# Altium schematic sheet TD3_TP2_Entradas Analogicas.SchDoc: Técnicas Digitales 3. Práctico 02: Acondicionador de señal
size A4; Date: 19/05/2025; Author: L. Campos; DrawnBy: L. Campos; SheetNumber: 1; SheetTotal: 1; Time: 20:45
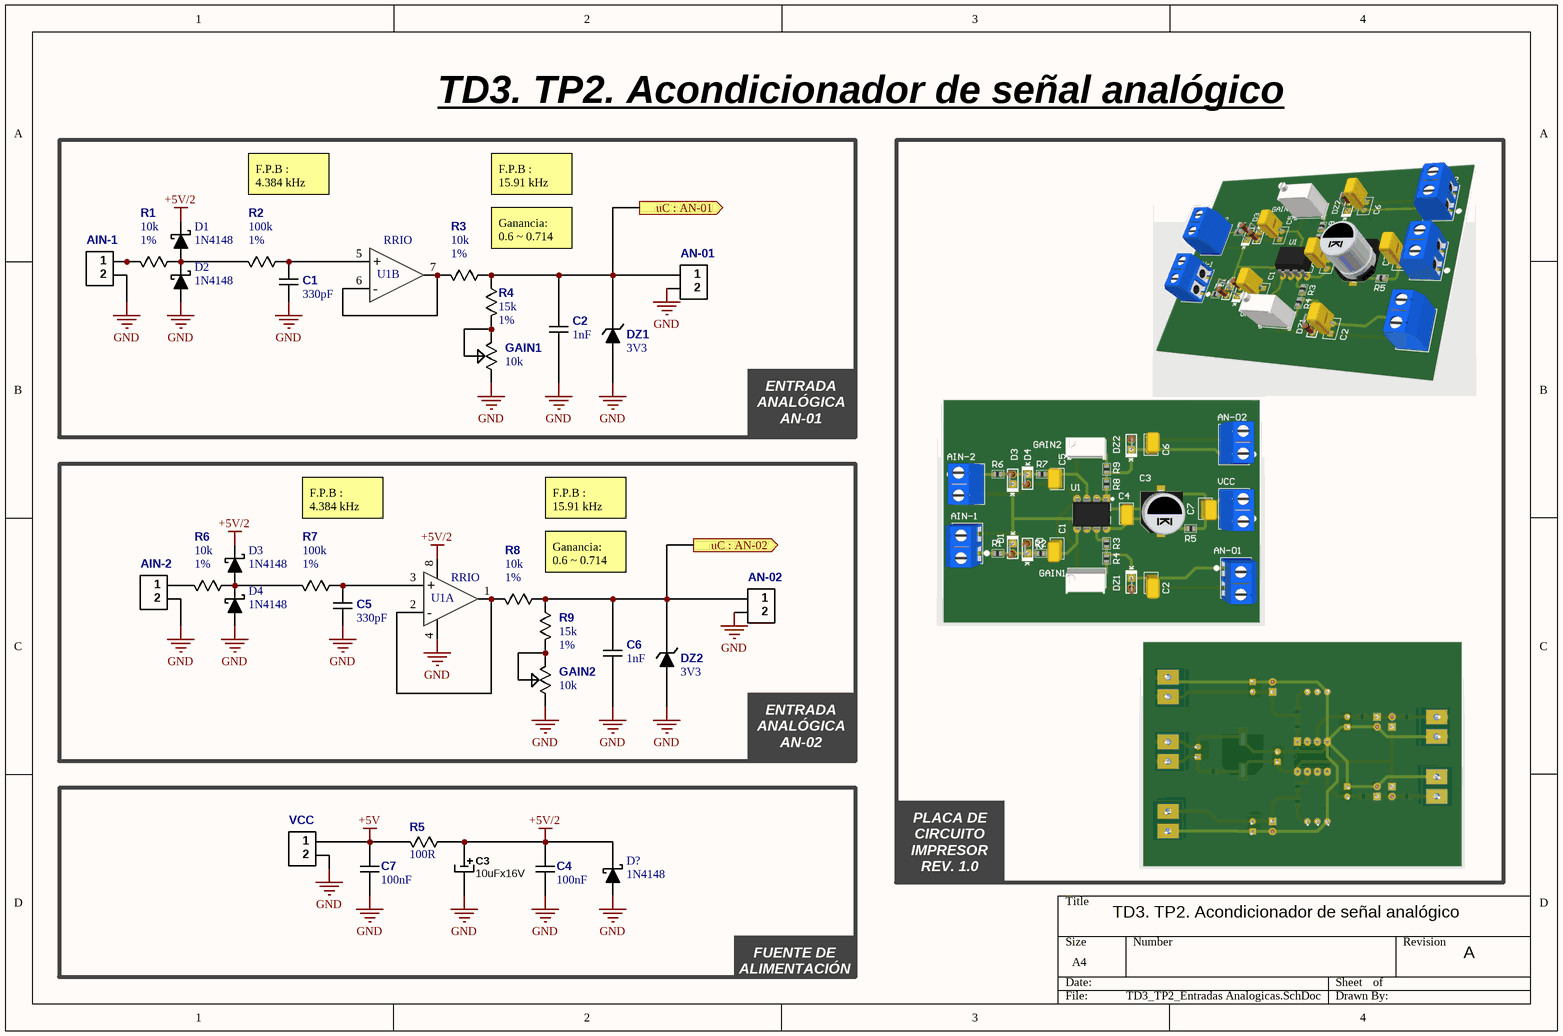
[diagram p0: TD3_TP2_Entradas Analogicas.SchDoc]

## Parts
AIN-1  CONN_2  [BORNERA_2]  (value not drawn)
AIN-2  CONN_2  [BORNERA_2]  (value not drawn)
AN-01  CONN_2  [BORNERA_2]  (value not drawn)
AN-02  CONN_2  [BORNERA_2]  (value not drawn)
C1  330pF  [CAP_0.1_V]
C2  1nF  [CAP_0.1_V]
C3  10uFx16V  [CAP_AL_10x12.7mm]
C4  100nF  [CAP_0.1_V]
C5  330pF  [CAP_0.1_V]
C6  1nF  [CAP_0.1_V]
C7  100nF  [CAP_0.1_V]
D1  1N4148  [DIODE_0.1_V]
D2  1N4148  [DIODE_0.1_V]
D3  1N4148  [DIODE_0.1_V]
D4  1N4148  [DIODE_0.1_V]
D?  1N4148  [DIODE_0.1_V]
DZ1  3V3  [DIODE_0.1_V]
DZ2  3V3  [DIODE_0.1_V]
GAIN1  10k  [TRIMPOT 3296W]
GAIN2  10k  [TRIMPOT 3296W]
R1  10k  Tolerancia: 1%  [RESISTOR 0805]
R2  100k  Tolerancia: 1%  [RESISTOR 0805]
R3  10k  Tolerancia: 1%  [RESISTOR 0805]
R4  15k  Tolerancia: 1%  [RESISTOR 0805]
R5  100R  [RESISTOR 0805]
R6  10k  Tolerancia: 1%  [RESISTOR 0805]
R7  100k  Tolerancia: 1%  [RESISTOR 0805]
R8  10k  Tolerancia: 1%  [RESISTOR 0805]
R9  15k  Tolerancia: 1%  [RESISTOR 0805]
U1  RRIO  [DIP_8_300]  (parts A,B of 2)
VCC  CONN_2  [BORNERA_2]  (value not drawn)

## Ports
uC : AN-01 (out), uC : AN-02 (out)

## Nets
+5V: C7.1 R5.2 VCC.1
+5V/2: C3.1 C4.1 D1.2 D3.2 D?.2 R5.1 U1.8(VCC)
GND: AIN-1.2 AIN-2.2 AN-01.2 AN-02.2 C1.1 C2.1 C3.2 C4.2 C5.1 C6.1 C7.2 D2.1 D4.1 D?.1 DZ1.1 DZ2.1 GAIN1.3 GAIN2.3 U1.4(GND) VCC.2
uC : AN-01: AN-01.1 C2.2 DZ1.2 R3.1 R4.1 ; port uC : AN-01
uC : AN-02: AN-02.1 C6.2 DZ2.2 R8.1 R9.1 ; port uC : AN-02
NetAIN-1_1: AIN-1.1 R1.2
NetAIN-2_1: AIN-2.1 R6.2
NetC1_2: C1.2 R2.1 U1.5(+)
NetC5_2: C5.2 R7.1 U1.3(+)
NetD1_1: D1.1 D2.2 R1.1 R2.2
NetD3_1: D3.1 D4.2 R6.1 R7.2
NetGAIN1_1: GAIN1.1 GAIN1.2 R4.2
NetGAIN2_1: GAIN2.1 GAIN2.2 R9.2
NetR3_2: R3.2 U1.6(-) U1.7(OUT)
NetR8_2: R8.2 U1.1(OUT) U1.2(-)

## Notes on the sheet
- TD3. TP2. Acondicionador de señal analógico
- F.P.B :
  4.384 kHz
- F.P.B :
  15.91 kHz
- Ganancia:
  0.6 ~ 0.714
- ENTRADA  ANALÓGICA  AN-01
- ENTRADA  ANALÓGICA  AN-02
- PLACA DE CIRCUITO IMPRESOR
  REV. 1.0
- FUENTE DE ALIMENTACIÓN
- A

## Library data of the parts
AIN-1 AIN-2 AN-01 AN-02 VCC = CONN_2: CONECTOR SMD 2 PINES; MFR PN: *; COMPONENTE: CONECTOR; DIGIKEY PN: *; DATASHEET: *; MONTAJE: SMD
C1 C2 C4-C7 = CAPACITOR NP: ENCAPSULADO: *; VALOR: *; MONTAJE: *; TENSION: *; DIELECTRICO: *; COMPONENTE: CAPACITOR; MFR PN: *; DIGIKEY PN: *; DATASHEET: *
C3 = CAP_ELECTR_0: Capacitor 10uF 16V tantalum chip capacitor smd case B; CLASE: 1; CODIGO: 8584; DESCRIPCION: Capacitor 10uF 16V tantalum chip capacitor smd case B; VERSION: 0; ENCAPSULADO: SMD
D1-D4 D? = DIODE SCHOTTKY: MFR PN: *; TENSIÓN INVERSA: *; CORRIENTE DIRECTA: *; MONTAJE: *; ENCAPSULADO: *; DIGIKEY PN: *
DZ1 DZ2 = DIODE ZENER: DIODO ZENER; MFR PN: *; TENSIÓN: *; POTENCIA: *; MONTAJE: *; ENCAPSULADO: *; DIGIKEY PN: *; DATASHEET: *; COMPONENTE: DIODO ZENER
GAIN1 GAIN2 = TRIMPOT: MONTAJE: SMD; VALOR: *; ENCAPSULADO: *; TENSIÓN: *; COMPONENTE: TRIMPOT; MFR PN: *; DIGIKEY PN: *; DATASHEET: *
R1-R9 = RESISTOR: VALOR: *; MONTAJE: *; ENCAPSULADO: *; TENSIÓN: *; COMPONENTE: RESISTOR; MFR PN: *; DIGIKEY PN: *; DATASHEET: *
U1 = OPAMP_DOBLE